# Altium schematic sheet PWR_TPS65265.SchDoc
size A3; SheetNumber: 21; SheetTotal: 22
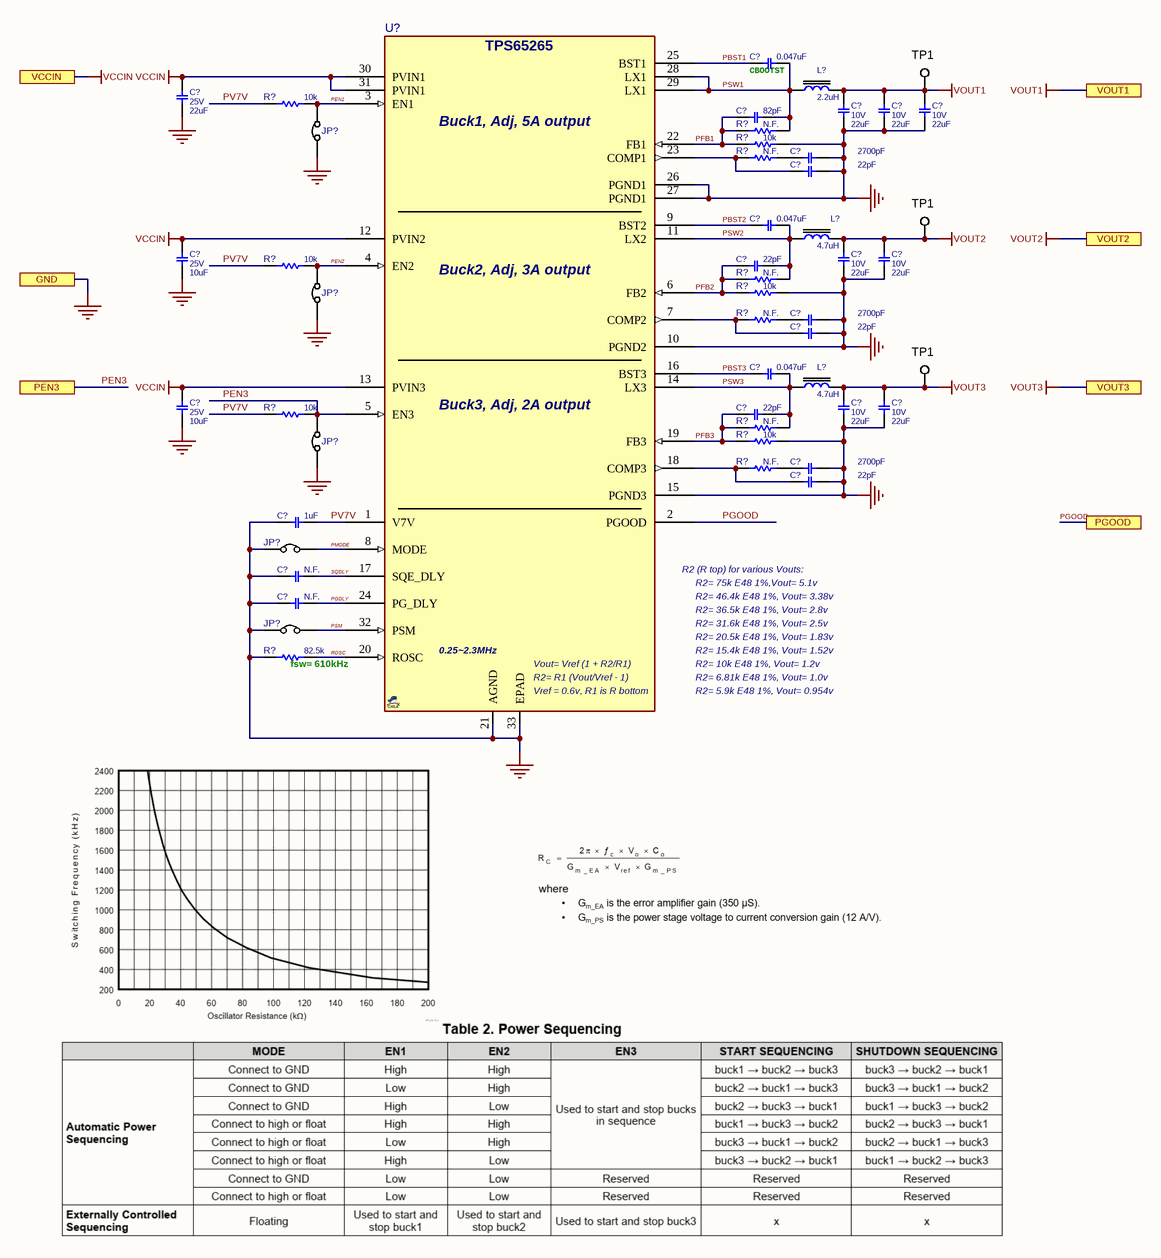
[diagram p0: PWR_TPS65265.SchDoc]

## Parts
(Parts that share a designator on the sheet are numbered #1, #2 ... from top to bottom, then left to right.)
C?#1  0.047uF  [C0402]
C?#2  PARAM2: 25V  [C0805]  (hidden comment: 22uF)
C?#3  82pF  [C0402]
C?#4  PARAM2: 10V  [C0603]  (hidden comment: 22uF)
C?#5  PARAM2: 10V  [C0603]  (hidden comment: 22uF)
C?#6  PARAM2: 10V  [C0603]  (hidden comment: 22uF)
C?#7  2700pF  [C0402]
C?#8  22pF  [C0402]
C?#9  0.047uF  [C0402]
C?#10  PARAM2: 25V  [C0805]  (hidden comment: 10uF)
C?#11  22pF  [C0402]
C?#12  PARAM2: 10V  [C0603]  (hidden comment: 22uF)
C?#13  PARAM2: 10V  [C0603]  (hidden comment: 22uF)
C?#14  2700pF  [C0402]
C?#15  22pF  [C0402]
C?#16  0.047uF  [C0402]
C?#17  PARAM2: 25V  [C0805]  (hidden comment: 10uF)
C?#18  22pF  [C0402]
C?#19  PARAM2: 10V  [C0603]  (hidden comment: 22uF)
C?#20  PARAM2: 10V  [C0603]  (hidden comment: 22uF)
C?#21  2700pF  [C0402]
C?#22  22pF  [C0402]
C?#23  1uF  [C0402]
C?#24  N.F.  [C0402]
C?#25  N.F.  [C0402]
JP?#1  JMPSOLDER  [JP_30X50]  (value not drawn)
JP?#2  JMPSOLDER  [JP_30X50]  (value not drawn)
JP?#3  JMPSOLDER  [JP_30X50]  (value not drawn)
JP?#4  JMPSOLDER  [JP_30X50]  (value not drawn)
JP?#5  JMPSOLDER  [JP_30X50]  (value not drawn)
L?#1  2.2uH  [L_6]
L?#2  4.7uH  [L_6]
L?#3  4.7uH  [L_6]
R?#1  10k  [R0402]
R?#2  N.F.  [R0402]
R?#3  10k  [R0402]
R?#4  N.F.  [R0402]
R?#5  10k  [R0402]
R?#6  N.F.  [R0402]
R?#7  10k  [R0402]
R?#8  N.F.  [R0402]
R?#9  10k  [R0402]
R?#10  N.F.  [R0402]
R?#11  10k  [R0402]
R?#12  N.F.  [R0402]
R?#13  82.5k  [R0402]
TP1#1  TESTPOINT_SMD  [TPSMD_S1]  (value not drawn)  (no BOM)
TP1#2  TESTPOINT_SMD  [TPSMD_S1]  (value not drawn)  (no BOM)
TP1#3  TESTPOINT_SMD  [TPSMD_S1]  (value not drawn)  (no BOM)
U?  TPS65265  [QFN50_32T]  (value not drawn)

## Ports
GND, PEN3, PGOOD, VCCIN, VOUT1, VOUT2, VOUT3

## Nets
GND: C?#2.1 C?#4.1 C?#5.1 C?#6.1 C?#7.2 C?#8.2 C?#10.1 C?#12.1 C?#13.1 C?#14.2 C?#15.2 C?#17.1 C?#19.1 C?#20.1 C?#21.2 C?#22.2 C?#23.1 C?#24.1 C?#25.1 JP?#1.1 JP?#2.1 JP?#3.1 JP?#4.1 JP?#5.1 R?#3.1 R?#7.1 R?#11.1 R?#13.1 U?.10(PGND2) U?.15(PGND3) U?.21(AGND) U?.26(PGND1) U?.27(PGND1) U?.33(EPAD) ; port GND
VCCIN: C?#2.2 C?#10.2 C?#17.2 U?.12(PVIN2) U?.13(PVIN3) U?.30(PVIN1) U?.31(PVIN1) ; port VCCIN
VOUT1: C?#4.2 C?#5.2 C?#6.2 L?#1.2 TP1#1.1 ; port VOUT1
VOUT2: C?#12.2 C?#13.2 L?#2.2 TP1#2.1 ; port VOUT2
VOUT3: C?#19.2 C?#20.2 L?#3.2 TP1#3.1 ; port VOUT3
PBST1: C?#1.1 U?.25(BST1)
PBST2: C?#9.1 U?.9(BST2)
PBST3: C?#16.1 U?.16(BST3)
PEN1: JP?#1.2 R?#1.1 U?.3(EN1)
PEN2: JP?#2.2 R?#5.1 U?.4(EN2)
PEN3: JP?#3.2 R?#9.1 U?.5(EN3) ; port PEN3
PFB1: C?#3.1 R?#2.2 R?#3.2 U?.22(FB1)
PFB2: C?#11.1 R?#6.2 R?#7.2 U?.6(FB2)
PFB3: C?#18.1 R?#10.2 R?#11.2 U?.19(FB3)
PGDLY: C?#25.2 U?.24(PG_DLY)
PGOOD: U?.2(PGOOD) ; port PGOOD
PMODE: JP?#4.2 U?.8(MODE)
PSM: JP?#5.2 U?.32(PSM)
PSW1: C?#1.2 C?#3.2 L?#1.1 R?#2.1 U?.28(LX1) U?.29(LX1)
PSW2: C?#9.2 C?#11.2 L?#2.1 R?#6.1 U?.11(LX2)
PSW3: C?#16.2 C?#18.2 L?#3.1 R?#10.1 U?.14(LX3)
PV7V: C?#23.2 R?#1.2 R?#5.2 R?#9.2 U?.1(V7V)
ROSC: R?#13.2 U?.20(ROSC)
SQDLY: C?#24.2 U?.17(SQE_DLY)
NetC?#7_1: C?#7.1 R?#4.1
NetC?#8_1: C?#8.1 R?#4.2 U?.23(COMP1)
NetC?#14_1: C?#14.1 R?#8.1
NetC?#15_1: C?#15.1 R?#8.2 U?.7(COMP2)
NetC?#21_1: C?#21.1 R?#12.1
NetC?#22_1: C?#22.1 R?#12.2 U?.18(COMP3)

## Notes on the sheet
- (near C?#1) CBOOTST
- (near U?) R2 (R top) for various Vouts:
- (near U?) R2= 75k E48 1%,Vout= 5.1v
- (near U?) R2= 46.4k E48 1%, Vout= 3.38v
- (near R?#13) fsw= 610kHz
- (near U?) R2= 36.5k E48 1%, Vout= 2.8v
- (near U?) R2= 31.6k E48 1%, Vout= 2.5v
- (near U?) R2= 20.5k E48 1%, Vout= 1.83v
- (near U?) R2= 15.4k E48 1%, Vout= 1.52v
- (near U?) R2= 10k E48 1%, Vout= 1.2v
- (near U?) R2= 6.81k E48 1%, Vout= 1.0v
- (near U?) R2= 5.9k E48 1%, Vout= 0.954v
- (in symbol TPS65265_QFN32) Buck1, Adj, 5A output; Buck2, Adj, 3A output; Buck3, Adj, 2A output; 0.25~2.3MHz; Vout= Vref (1 + R2/R1); R2= R1 (Vout/Vref - 1); Vref = 0.6v, R1 is R bottom

## Library data of the parts
C?#1 C?#3 C?#7-C?#9 C?#11 C?#14-C?#16 C?#18 C?#21 C?#22 = CAP_SMD_MLCC_100n50V: CAP, MLCC, 100nF, 50V, X7R, 10%, 0402C; PARAM: X5R, 10%; MANF: Murata; PARAM2: 25v; MANF_P#: GRM155R61E104; DESC: CAP, MLCC, 100nF, 50V, X7R, 10%, 0402C; ASSEMBLY: ASSEMBLY; PRICE: 10,000:$0.006
  C?#1 C?#9 C?#16: VALUE: 0.047uF
  C?#3: VALUE: 82pF
  C?#7 C?#14 C?#21: VALUE: 2700pF
  C?#8 C?#11 C?#15 C?#18 C?#22: VALUE: 22pF
C?#2 = CAP_SMD_MLCC_100n50V: CAP, MLCC, 0402C; PARAM: X5R, 20%; MANF_P#: CL21A226MAYNNNE; MANF: -; DESC: -; ASSEMBLY: ASSEMBLY; PRICE: 100: 0.1$; VALUE: 22uF
C?#4-C?#6 C?#12 C?#13 C?#19 C?#20 = CAP_SMD_MLCC_100n50V: CAP, MLCC, 0402C; PARAM: X5R, 20%; MANF_P#: CL10A106MP8NNNC; MANF: -; DESC: -; ASSEMBLY: ASSEMBLY; PRICE: -; VALUE: 22uF
C?#10 C?#17 = CAP_SMD_MLCC_100n50V: CAP, MLCC, 0402C; PARAM: X5R, 20%; MANF: -; DESC: -; ASSEMBLY: ASSEMBLY; PRICE: 100: 0.1$; VALUE: 10uF; MANF_P#: -
C?#23-C?#25 = CAP_SMD_MLCC_100n50V: CAP, MLCC, 0402C; PARAM: 50V; MANF: -; DESC: -; PARAM2: -; ASSEMBLY: ASSEMBLY; PRICE: 100= 1.3$; MANF_P#: -
  C?#23: VALUE: 1uF
  C?#24 C?#25: VALUE: N.F.
JP?#1-JP?#5 = JUMPER_SOLDER: JUMPER, HEADER 2PIN; MANF: MANF; MANF_P#: MANF_P#; VALUE: JMPSOLDER
L?#1 = IND_SMD_2.2uH_4A: INDUCTOR; PARAM: 6A (Irms), 9.5A Isat; MANF: Bourns; PARAM2: 15mOhm; MANF_P#: SRN6045TA-2R2Y; PRICE: -; ASSEMBLY: ASSEMBLY; VALUE: 2.2uH
L?#2 L?#3 = IND_SMD_2.2uH_4A: INDUCTOR; PARAM: 3.6A (Irms), 7A Isat; MANF: Bourns; PARAM2: 30mOhm; MANF_P#: SRN6045HA-4R7Y; PRICE: -; ASSEMBLY: ASSEMBLY; VALUE: 4.7uH
R?#1-R?#13 = RES_SMD: RESISTOR, SMD, 20K, 0402; PARAM: 0.063W; DIST#: MOUSER; PARAM2: 1%; MANF: -; ASSEMBLY: ASSEMBLY; PRICE: 100= 0.5$; DESC: RESISTOR, SMD, 20K, 0402; MANF_P#: -
  R?#1 R?#3 R?#5 R?#7 R?#9 R?#11: VALUE: 10k
  R?#2 R?#4 R?#6 R?#8 R?#10 R?#12: VALUE: N.F.
  R?#13: VALUE: 82.5k
TP1#1-TP1#3 = TESTPOINT_SMD: TEST POINT; MANF: MANF; MANF_P#: MANF_P#; VALUE: VALUE
U? = TPS65265_QFN32: PMIC, 3 buck, QFN-32; MANF: Texas Instruments; PARAM: 3 buck, -40~125°C; PARAM2: 4.5~17VIN; MANF_P#: TPS65265RHB; PRICE: 2$; ASSEMBLY: ASSEMBLY; VALUE: TPS65265